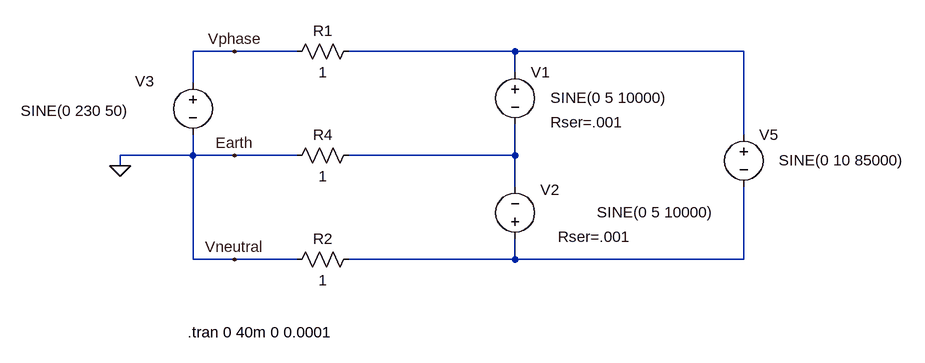
[diagram p0: schematic Draft3.asc]
Draft3.asc, the LTspice schematic file:
Version 4
SHEET 1 988 680
WIRE -144 0 -208 0
WIRE -48 0 -144 0
WIRE 288 0 32 0
WIRE 640 0 288 0
WIRE 288 32 288 0
WIRE -208 48 -208 0
WIRE 640 128 640 0
WIRE -208 160 -208 128
WIRE -208 160 -320 160
WIRE -144 160 -208 160
WIRE -48 160 -144 160
WIRE 288 160 288 112
WIRE 288 160 32 160
WIRE -320 176 -320 160
WIRE 288 208 288 160
WIRE -208 320 -208 160
WIRE -144 320 -208 320
WIRE -48 320 -144 320
WIRE 288 320 288 288
WIRE 288 320 32 320
WIRE 640 320 640 208
WIRE 640 320 288 320
FLAG -320 176 0
FLAG -144 0 Vphase
FLAG -144 320 Vneutral
FLAG -144 160 Earth
SYMBOL voltage 288 16 R0
WINDOW 3 54 55 Left 2
WINDOW 123 0 0 Left 2
WINDOW 39 54 93 Left 2
SYMATTR Value SINE(0 5 10000)
SYMATTR SpiceLine Rser=.001
SYMATTR InstName V1
SYMBOL voltage 288 304 R180
WINDOW 0 -68 91 Left 2
WINDOW 3 -306 57 Left 2
WINDOW 123 0 0 Left 2
WINDOW 39 -178 19 Left 2
SYMATTR InstName V2
SYMATTR Value SINE(0 5 10000)
SYMATTR SpiceLine Rser=.001
SYMBOL voltage -208 32 R0
WINDOW 3 -265 59 Left 2
WINDOW 123 0 0 Left 2
WINDOW 39 54 93 Left 2
WINDOW 0 -89 14 Left 2
SYMATTR Value SINE(0 230 50)
SYMATTR InstName V3
SYMBOL res 48 -16 R90
WINDOW 0 0 56 VBottom 2
WINDOW 3 32 56 VTop 2
SYMATTR InstName R1
SYMATTR Value 1
SYMBOL res 48 304 R90
WINDOW 0 0 56 VBottom 2
WINDOW 3 32 56 VTop 2
SYMATTR InstName R2
SYMATTR Value 1
SYMBOL voltage 640 112 R0
WINDOW 3 54 55 Left 2
WINDOW 123 0 0 Left 2
WINDOW 39 0 0 Left 2
SYMATTR Value SINE(0 10 85000)
SYMATTR InstName V5
SYMBOL res 48 144 R90
WINDOW 0 0 56 VBottom 2
WINDOW 3 32 56 VTop 2
SYMATTR InstName R4
SYMATTR Value 1
TEXT -216 432 Left 2 !.tran 0 40m 0 0.0001

The netlist it stands for:
* Draft3.asc
V1 N001 N002 SINE(0 5 10000) Rser=.001
V2 N003 N002 SINE(0 5 10000) Rser=.001
V3 Vphase 0 SINE(0 230 50)
R1 N001 Vphase 1
R2 N003 0 1
V5 N001 N003 SINE(0 10 85000)
R4 N002 0 1
.tran 0 40m 0 0.0001
.backanno
.end